# EasyEDA schematic SCH_ESP32 + red MP3 card_2022-04-29.json
TITLE: Sheet_1; REV: 1.0; Date: 2022-04-26; Sheet: 1/1; Drawn By: bussbullen; Company: Your Company
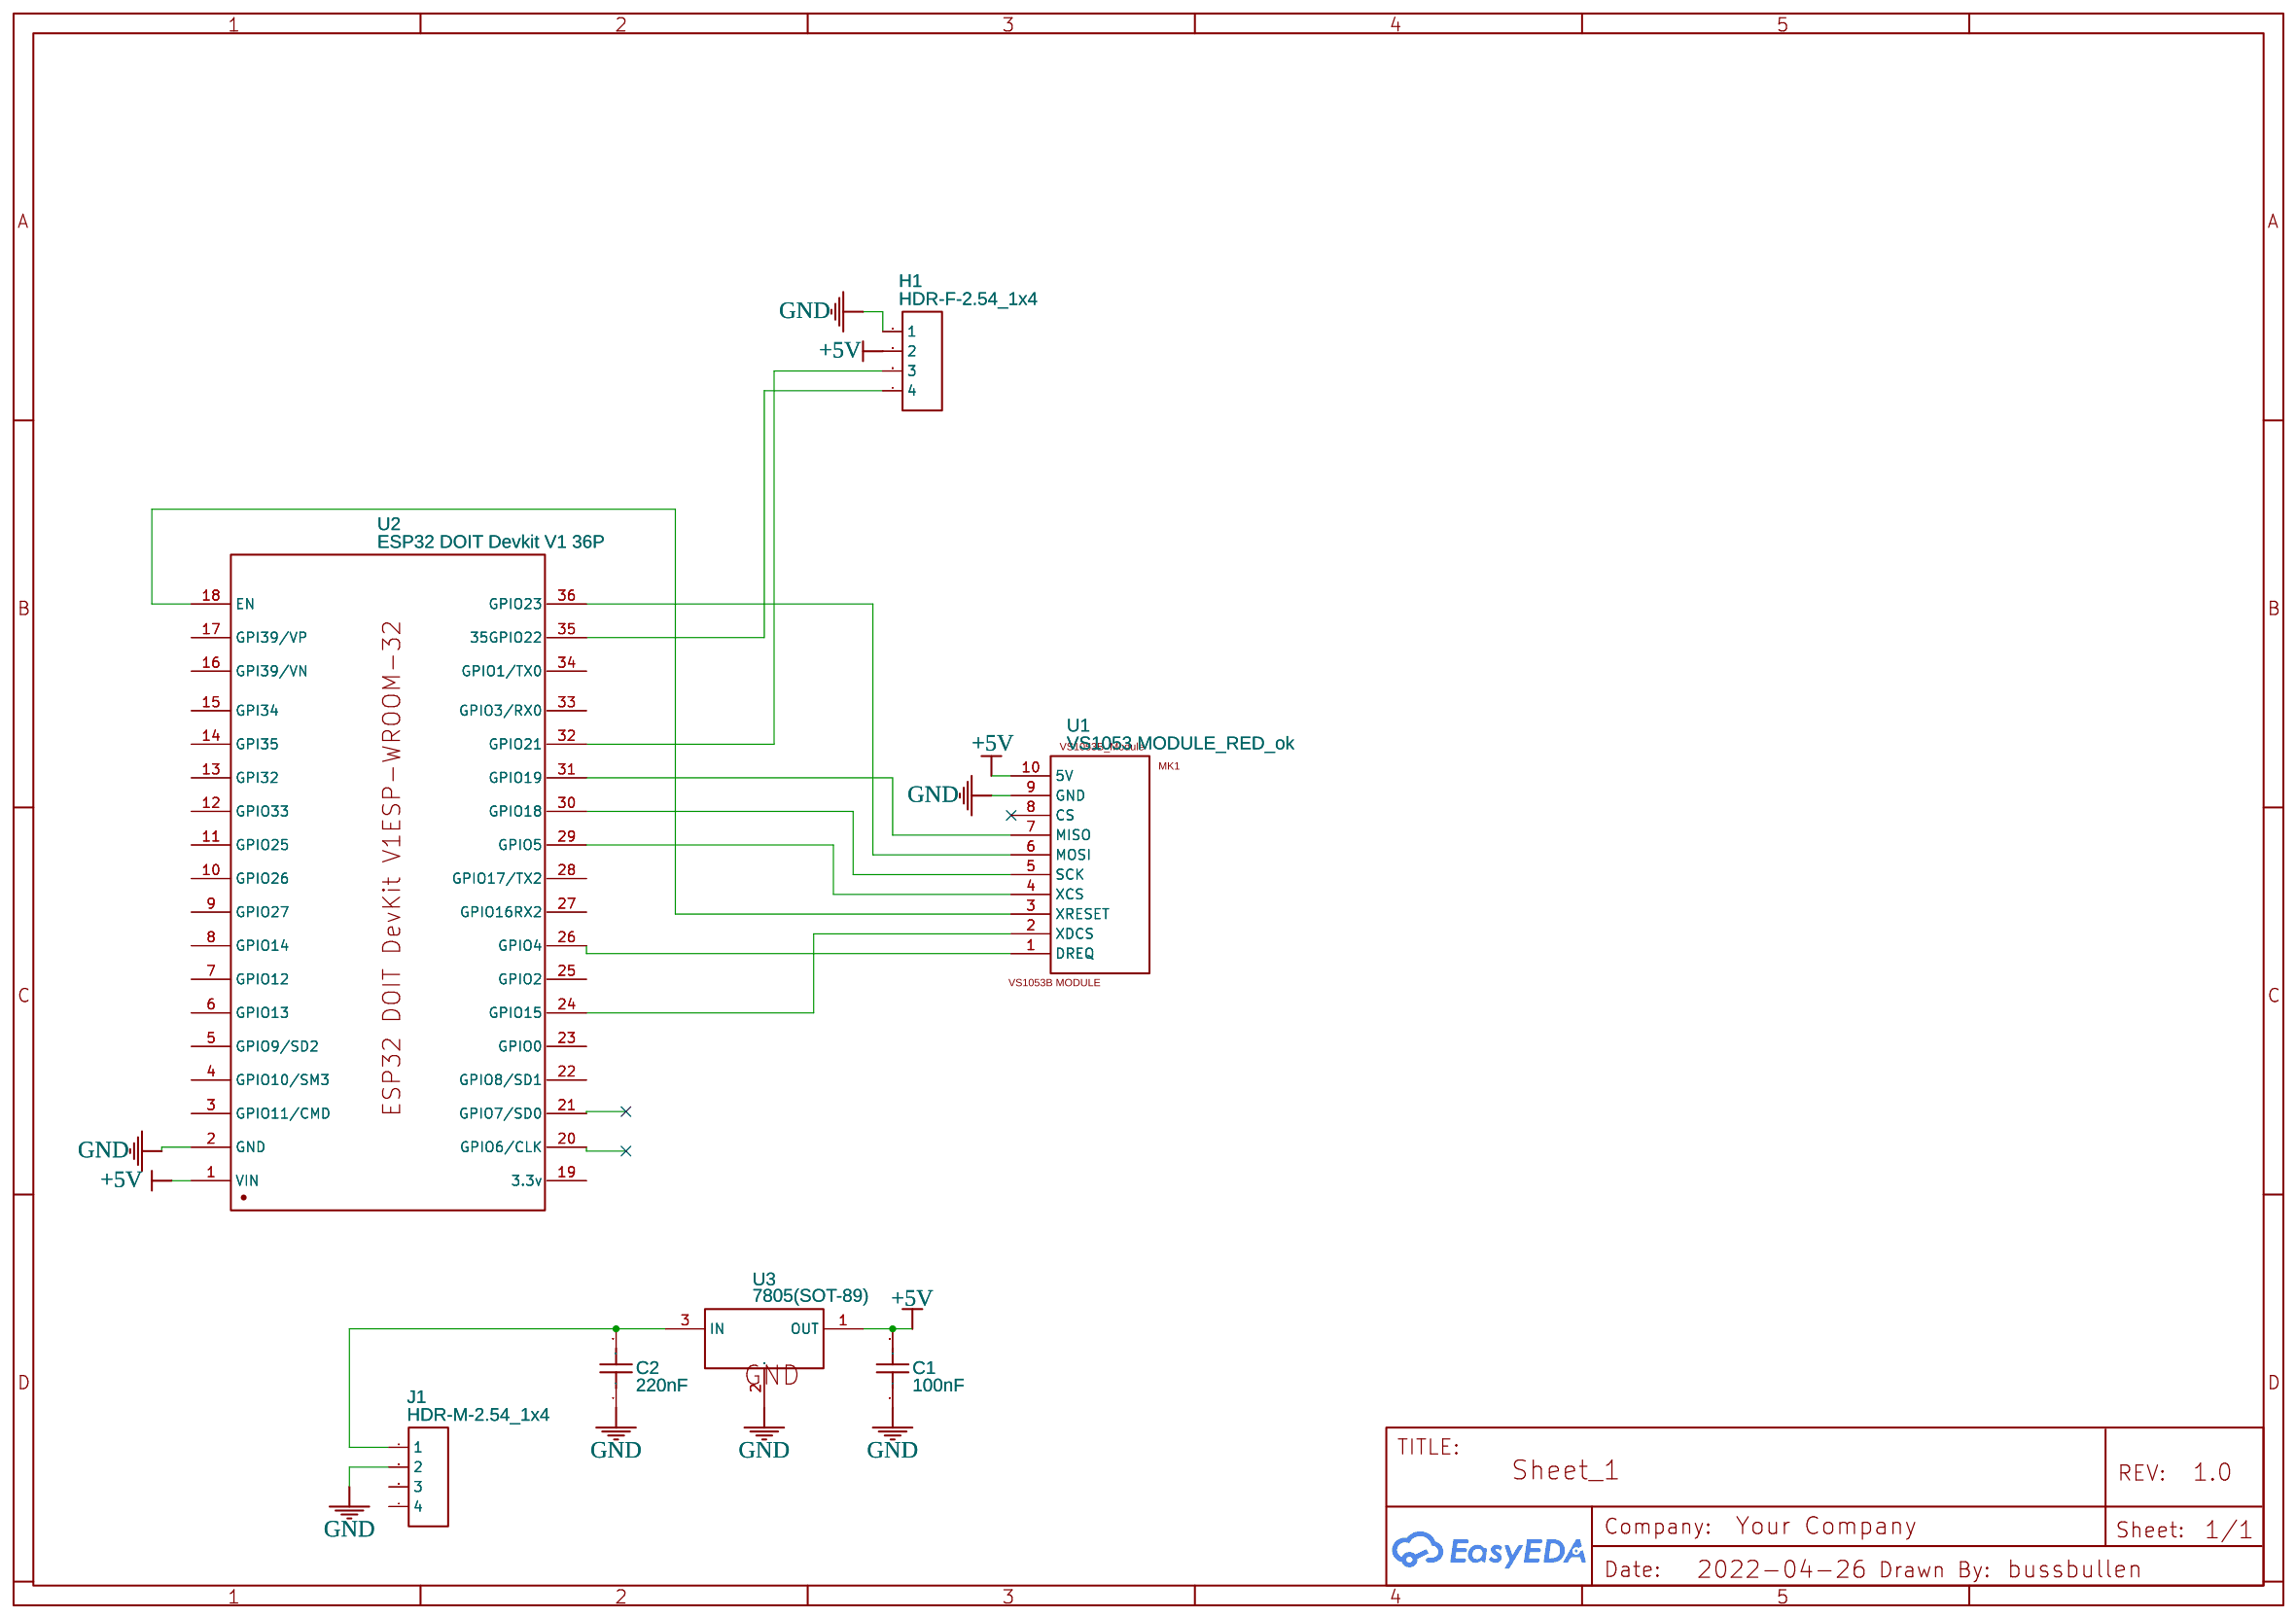
[diagram p0: schematic sheet]

## Parts
C1  100nF  [CAP-TH_L7.2-W2.5-P5.00-D0.6]
C2  220nF  [CAP-TH_L7.2-W2.5-P5.00-D0.6]
H1  HDR-F-2.54_1x4  [HDR-F-2.54_1X4]
J1  HDR-M-2.54_1x4  [HDR-M-2.54_1X4]
U1  VS1053 MODULE_RED_ok  [VS1053B MODULE_V2]
U2  ESP32 DOIT Devkit V1 36P  [ESP32 DOIT DEVKIT V1 36P-FOOTPRINT]
U3  7805(SOT-89)  [SOT-89-3_L4.5-W2.5-P1.50-LS4.2-BR]

## Library data of the parts
C1 = SMEC104J100M1: Supplier: LCSC; Supplier Part: C401095; Manufacturer: CHAMPION; Contributor: LCSC; JLCPCB Part Class: Extended Part
C2 = SMEC224J100M2: Supplier: LCSC; Supplier Part: C401099; Manufacturer: CHAMPION; Contributor: LCSC; JLCPCB Part Class: Extended Part
H1 = HDR-F-2.54_1x4: Supplier Part: C225501; Supplier: LCSC; Contributor: LCEDA_Lib
J1 = HDR-M-2.54_1x4: Supplier Part: C124378; Supplier: LCSC; Contributor: LCEDA_Lib
U1 = VS1053 MODULE_RED_ok: Contributor: Dorin Nicoara
U2 = ESP32 DOIT Devkit V1 36P: Supplier: DOIT; Contributor: karllwatts
U3 = 7805(SOT-89): Supplier: LCSC; Manufacturer: CJ; Manufacturer Part: CJ78L05; image: //image.lceda.cn/szlcsc/C2079.jpg; Supplier Part: C2079; Paste Type: expand; Contributor: LCEDA_Lib

## Nets
+5V: C1.2 H1.2 U1.10(5V) U2.1(VIN) U3.1(OUT)
GND: C1.1 C2.1 H1.1 J1.2 U1.9(GND) U2.2(GND) U3.2(GND)
Net-(C2-2): C2.2 J1.1 U3.3(IN)
Net-(H1-3): H1.3 U2.32(GPIO21)
Net-(H1-4): H1.4 U2.35(35GPIO22)
Net-(U1-1): U1.1(DREQ) U2.26(GPIO4)
Net-(U1-2): U1.2(XDCS) U2.24(GPIO15)
Net-(U1-3): U1.3(XRESET) U2.18(EN)
Net-(U1-4): U1.4(XCS) U2.29(GPIO5)
Net-(U1-5): U1.5(SCK) U2.30(GPIO18)
Net-(U1-6): U1.6(MOSI) U2.36(GPIO23)
Net-(U1-7): U1.7(MISO) U2.31(GPIO19)

Not connected (* = marked no-connect by the designer): J1 3 4; U1 8(CS)*; U2 3(GPIO11/CMD) 4(GPIO10/SM3) 5(GPIO9/SD2) 6(GPIO13) 7(GPIO12) 8(GPIO14) 9(GPIO27) 10(GPIO26) 11(GPIO25) 12(GPIO33) 13(GPI32) 14(GPI35) 15(GPI34) 16(GPI39/VN) 17(GPI39/VP) 19(3.3v) 20(GPIO6/CLK) 21(GPIO7/SD0) 22(GPIO8/SD1) 23(GPIO0) 25(GPIO2) 27(GPIO16RX2) 28(GPIO17/TX2) 33(GPIO3/RX0) 34(GPIO1/TX0)
